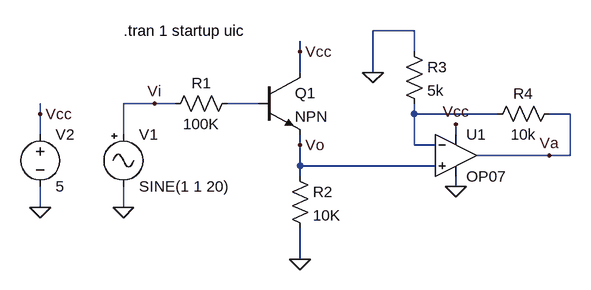
[diagram p0: schematic Draft1.asc]
Draft1.asc, the LTspice schematic file:
Version 4
SHEET 1 880 680
WIRE 592 80 528 80
WIRE 416 112 416 96
WIRE 592 112 592 80
WIRE 416 144 416 112
WIRE 528 144 528 80
WIRE 192 192 144 192
WIRE 224 192 192 192
WIRE 352 192 304 192
WIRE 16 208 16 192
WIRE 592 208 592 192
WIRE 720 208 592 208
WIRE 832 208 800 208
WIRE 16 240 16 208
WIRE 144 240 144 192
WIRE 656 240 656 224
WIRE 416 256 416 240
WIRE 592 256 592 208
WIRE 624 256 592 256
WIRE 800 272 688 272
WIRE 832 272 832 208
WIRE 832 272 800 272
WIRE 416 288 416 256
WIRE 624 288 416 288
WIRE 416 304 416 288
WIRE 656 320 656 304
WIRE 16 352 16 320
WIRE 144 352 144 320
WIRE 416 432 416 384
FLAG 144 352 0
FLAG 16 352 0
FLAG 16 208 Vcc
FLAG 416 112 Vcc
FLAG 416 432 0
FLAG 416 256 Vo
FLAG 192 192 Vi
FLAG 528 144 0
FLAG 656 224 Vcc
FLAG 656 320 0
FLAG 800 272 Va
SYMBOL Misc/signal 144 224 R0
SYMATTR InstName V1
SYMATTR Value SINE(1 1 20)
SYMBOL res 320 176 R90
WINDOW 0 0 56 VBottom 2
WINDOW 3 32 56 VTop 2
SYMATTR InstName R1
SYMATTR Value 100K
SYMBOL npn 352 144 R0
SYMATTR InstName Q1
SYMBOL voltage 16 224 R0
SYMATTR InstName V2
SYMATTR Value 5
SYMBOL res 400 288 R0
SYMATTR InstName R2
SYMATTR Value 10K
SYMBOL Opamps/OP07 656 208 R0
SYMATTR InstName U1
SYMBOL res 576 96 R0
SYMATTR InstName R3
SYMATTR Value 5k
SYMBOL res 816 192 R90
WINDOW 0 0 56 VBottom 2
WINDOW 3 32 56 VTop 2
SYMATTR InstName R4
SYMATTR Value 10k
TEXT 144 80 Left 2 !.tran 1 startup uic

The netlist it stands for:
* Draft1.asc
V1 Vi 0 SINE(1 1 20)
R1 N001 Vi 100K
Q1 Vcc N001 Vo 0 NPN
V2 Vcc 0 5
R2 Vo 0 10K
XU1 Vo N002 Vcc 0 Va LT1001  ; OP07, pins In+ In- V+ V- OUT
R3 0 N002 5k
R4 Va N002 10k
.model NPN NPN
.model PNP PNP
.lib standard.bjt
.tran 1 startup uic
.lib LTC.lib
.backanno
.end